# EAGLE schematic omnetics_to_electrode2 (EAGLE 7.2.0)
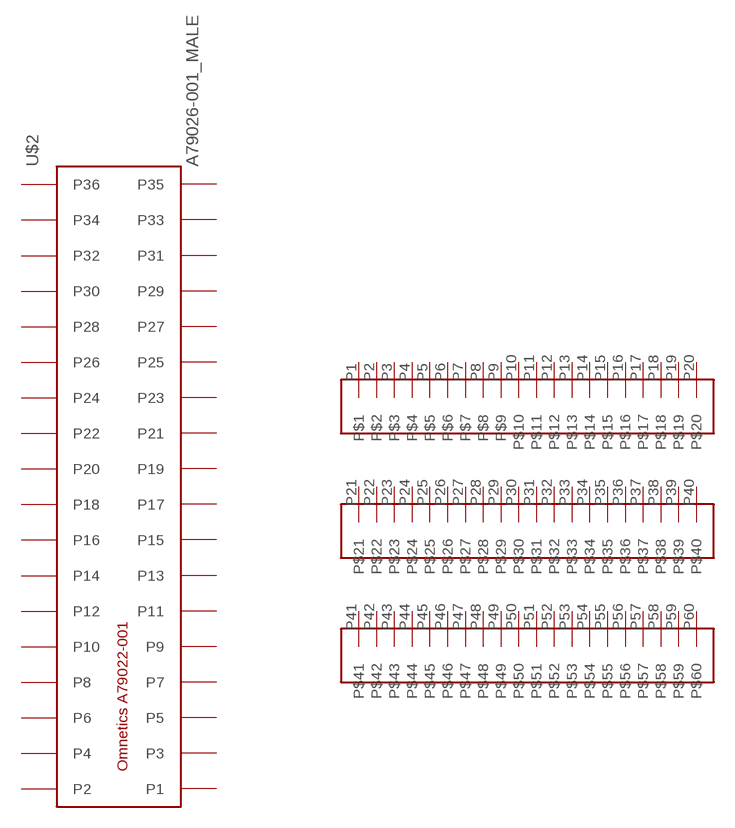
[diagram p0: schematic, sheet 1]

## Parts
U$1  ELEC_CONNECTOR  [ELEC_CONNECTOR]
U$2  A79026-001_MALE  [A79026-001_MALE]
Unconnected: U$1.P1 U$1.P2 U$1.P3 U$1.P4 U$1.P5 U$1.P6 U$1.P7 U$1.P8 U$1.P9 U$1.P10 U$1.P11 U$1.P12 U$1.P13 U$1.P14 U$1.P15 U$1.P16 U$1.P17 U$1.P18 U$1.P19 U$1.P20 U$1.P21 U$1.P22 U$1.P23 U$1.P24 U$1.P25 U$1.P26 U$1.P27 U$1.P28 U$1.P29 U$1.P30 U$1.P31 U$1.P32 U$1.P33 U$1.P34 U$1.P35 U$1.P36 U$1.P37 U$1.P38 U$1.P39 U$1.P40 U$1.P41 U$1.P42 U$1.P43 U$1.P44 U$1.P45 U$1.P46 U$1.P47 U$1.P48 U$1.P49 U$1.P50 U$1.P51 U$1.P52 U$1.P53 U$1.P54 U$1.P55 U$1.P56 U$1.P57 U$1.P58 U$1.P59 U$1.P60 U$2.P1 U$2.P2 U$2.P3 U$2.P4 U$2.P5 U$2.P6 U$2.P7 U$2.P8 U$2.P9 U$2.P10 U$2.P11 U$2.P12 U$2.P13 U$2.P14 U$2.P15 U$2.P16 U$2.P17 U$2.P18 U$2.P19 U$2.P20 U$2.P21 U$2.P22 U$2.P23 U$2.P24 U$2.P25 U$2.P26 U$2.P27 U$2.P28 U$2.P29 U$2.P30 U$2.P31 U$2.P32 U$2.P33 U$2.P34 U$2.P35 U$2.P36

## Library data of the parts
U$1 = mayo_parts:ELEC_CONNECTOR
U$2 = omnetics:A79026-001_MALE